# Altium schematic sheet Channel-B2.schdoc
size A4; SheetNumber: 2; SheetTotal: 5
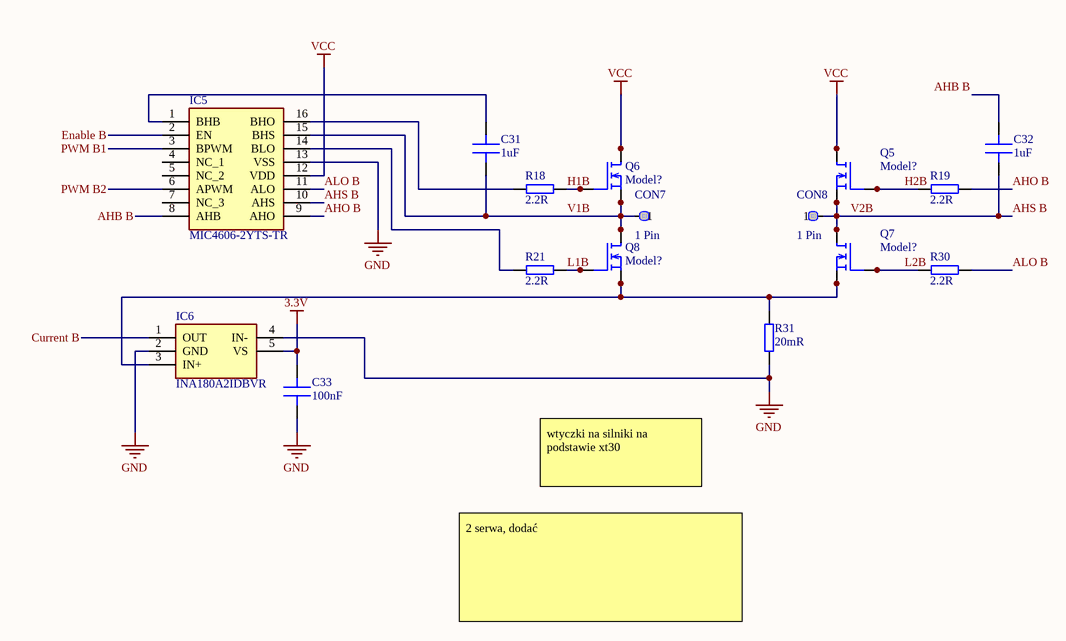
[diagram p0: Channel-B2.schdoc]

## Parts
C31  1uF  [C 0603]
C32  1uF  [C 0603]
C33  100nF  [C 0402]
CON7  1 Pin  [SMD PAD]
CON8  1 Pin  [SMD PAD]
IC5  MIC4606-2YTS-TR  [SOP65P640X120-16N]
IC6  INA180A2IDBVR  [SOT95P280X145-5N]
Q5  Model?  [DFN 3X3]
Q6  Model?  [DFN 3X3]
Q7  Model?  [DFN 3X3]
Q8  Model?  [DFN 3X3]
R18  2.2R  [R 0402]
R19  2.2R  [R 0402]
R21  2.2R  [R 0402]
R30  2.2R  [R 0402]
R31  20mR  [R 2512]

## Nets
3.3V: C33.1 IC6.5(VS)
GND: C33.2 IC5.13(VSS) IC6.2(GND) IC6.4(IN-) R31.1
VCC: IC5.12(VDD) Q5.5_8(D) Q6.5_8(D)
AHB B: C32.1 IC5.8(AHB)
AHO B: IC5.9(AHO) R19.1
AHS B: C32.2 CON8.1 IC5.10(AHS) Q5.1,2,3(S) Q5.1,_2,_3(S) Q7.5_8(D)  [also labelled V2B]
ALO B: IC5.11(ALO) R30.1
Current B: IC6.1(OUT)
Enable B: IC5.2(EN)
H1B: Q6.4(G) R18.2
H2B: Q5.4(G) R19.2
L1B: Q8.4(G) R21.2
L2B: Q7.4(G) R30.2
PWM B1: IC5.3(BPWM)
PWM B2: IC5.6(APWM)
V1B: C31.2 CON7.1 IC5.15(BHS) Q6.1,2,3(S) Q6.1,_2,_3(S) Q8.5_8(D)
NetC31_1: C31.1 IC5.1(BHB)
NetIC5_14: IC5.14(BLO) R21.1
NetIC5_16: IC5.16(BHO) R18.1
NetIC6_3: IC6.3(IN+) Q7.1,2,3(S) Q7.1,_2,_3(S) Q8.1,2,3(S) Q8.1,_2,_3(S) R31.2

Not connected (* = marked no-connect by the designer): IC5 4(NC_1) 5(NC_2) 7(NC_3)

## Notes on the sheet
- wtyczki na silniki na podstawie xt30
- 2 serwa, dodać

## Library data of the parts
C31-C33 = Capacitor: MLCC Capacitor
IC5 = MIC4606-2YTS-TR: Integrated Circuit; Manufacturer_Name: Microchip; Datasheet Link: https://eu.mouser.com/datasheet/2/268/20005604B-1286645.pdf; Height: 1.2mm; Manufacturer_Part_Number: MIC4606-2YTS-TR; Mouser Part Number: 579-MIC4606-2YTS-TR; Mouser Price/Stock: https://www.mouser.co.uk/ProductDetail/Microchip-Technology/MIC4606-2YTS-TR?qs=fxR7EJxuiMGiGNq6G0IdXQ%3D%3D; Arrow Part Number: MIC4606-2YTS-TR; Arrow Price/Stock: https://www.arrow.com/en/products/mic4606-2yts-tr/microchip-technology?region=nac
IC6 = INA180A2IDBVR: Integrated Circuit; Manufacturer_Name: Texas Instruments; Datasheet Link: http://www.ti.com/lit/ds/symlink/ina180.pdf; Height: 1.45mm; Manufacturer_Part_Number: INA180A2IDBVR; Mouser Part Number: 595-INA180A2IDBVR; Mouser Price/Stock: https://www.mouser.co.uk/ProductDetail/Texas-Instruments/INA180A2IDBVR?qs=5aG0NVq1C4wYcJfa99BoHg%3D%3D; Arrow Part Number: INA180A2IDBVR; Arrow Price/Stock: https://www.arrow.com/en/products/ina180a2idbvr/texas-instruments?region=nac
Q5-Q8 = Power MOSFET: N-Mosfet DFN 5x6
R18 R19 R21 R30 R31 = Resistor: General pourpouse resistor